# EAGLE design 328_v2 (EAGLE 7.2.0)
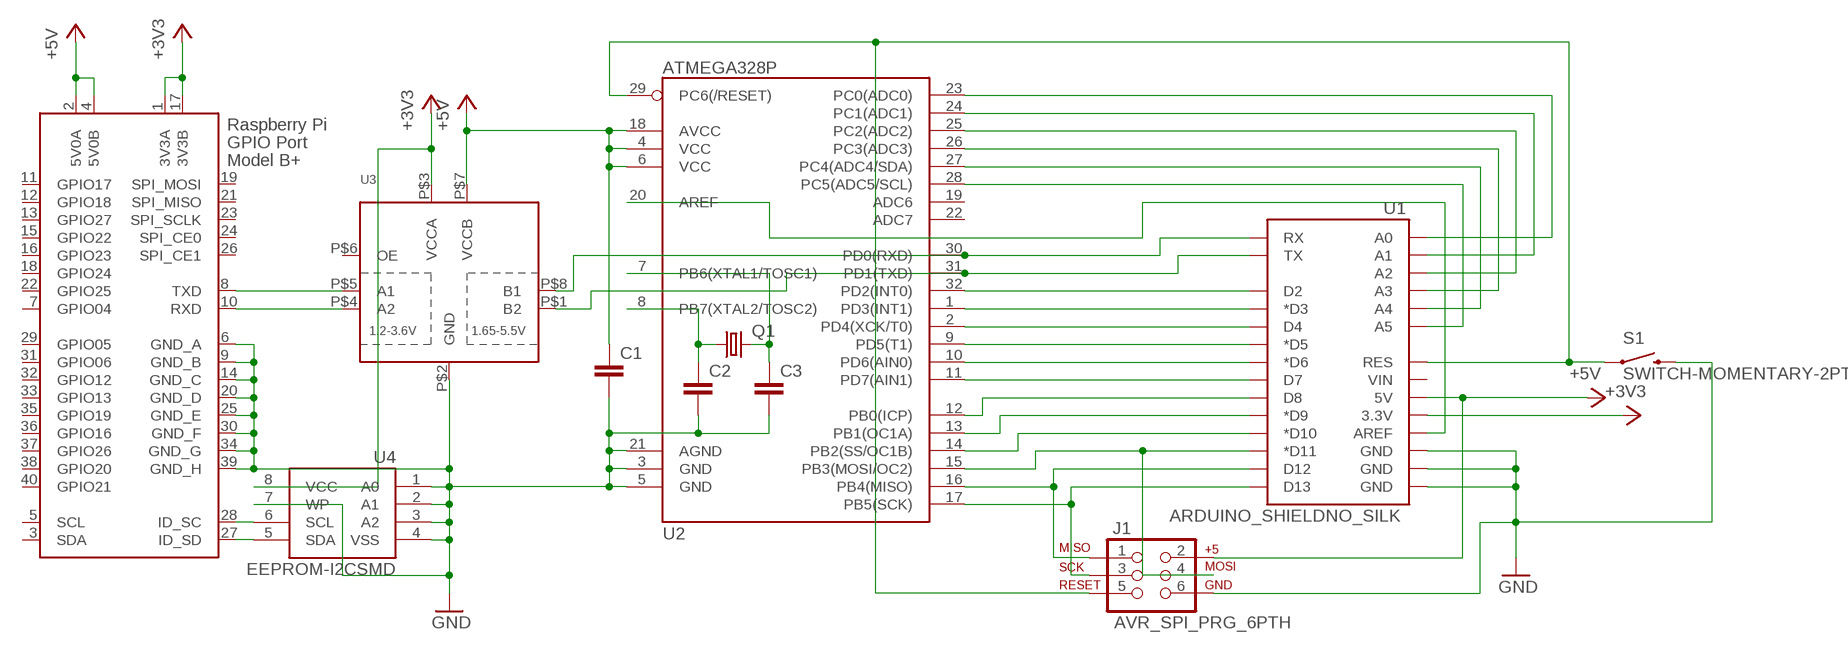
[diagram p0: schematic, sheet 1]

## Parts
C1  C-EUC0805K  [C0805K]
C2  C-EUC0805K  [C0805K]
C3  C-EUC0805K  [C0805K]
J1  AVR_SPI_PRG_6PTH  [2X3]
Q1  CRYSTALCTS406  [CTS406]
S1  SWITCH-MOMENTARY-2PTH  [TACTILE-PTH]
U1  ARDUINO_SHIELDNO_SILK  [DUEMILANOVE_VIAS]
U2  ATMEGA328P  ATMEGA328_SMT  [TQFP32-08]
U3  TXS0102  [VFSOP-8]
U4  EEPROM-I2CSMD  [SO08]
X1  RASPI_BOARD_B+#_H  [RASPI_BOARD_B+HAT]

## Nets
+3V3: U1.3.3V U3.P$3(VCCA) U4.8(VCC) X1.1(3V3A) X1.17(3V3B)
+5V: C1.1 J1.2 U1.5V U2.4(VCC) U2.6(VCC) U2.18(AVCC) U3.P$7(VCCB) X1.2(5V0A) X1.4(5V0B)
GND: C1.2 C2.2 C3.2 J1.6 S1.3 U1.GND@0(GND) U1.GND@1(GND) U1.GND@2(GND) U2.3(GND) U2.5(GND) U2.21(AGND) U3.P$2(GND) U4.1(A0) U4.2(A1) U4.3(A2) U4.4(VSS) U4.7(WP) X1.6(GND_A) X1.9(GND_B) X1.14(GND_C) X1.20(GND_D) X1.25(GND_E) X1.30(GND_F) X1.34(GND_G) X1.39(GND_H)
N$1: U3.P$5(A1) X1.8(TXD)
N$2: U3.P$4(A2) X1.10(RXD)
N$3: U1.RX U2.30(PD0(RXD)) U3.P$8(B1)
N$4: U1.TX U2.31(PD1(TXD)) U3.P$1(B2)
N$5: J1.1 U1.D12 U2.16(PB4(MISO))
N$6: U1.AREF U2.20(AREF)
N$7: U1.D2 U2.32(PD2(INT0))
N$8: U1.D3(*D3) U2.1(PD3(INT1))
N$9: U1.D4 U2.2(PD4(XCK/T0))
N$10: U1.D5(*D5) U2.9(PD5(T1))
N$11: U1.D6(*D6) U2.10(PD6(AIN0))
N$12: U1.D7 U2.11(PD7(AIN1))
N$13: U1.D8 U2.12(PB0(ICP))
N$14: U1.D9(*D9) U2.13(PB1(OC1A))
N$15: U1.D10(*D10) U2.14(PB2(SS/OC1B))
N$16: C3.1 Q1.3 U2.7(PB6(XTAL1/TOSC1))
N$17: J1.4 U1.D11(*D11) U2.15(PB3(MOSI/OC2))
N$18: J1.3 U1.D13 U2.17(PB5(SCK))
N$19: U1.A5 U2.28(PC5(ADC5/SCL))
N$20: U1.A4 U2.27(PC4(ADC4/SDA))
N$21: U1.A3 U2.26(PC3(ADC3))
N$22: U1.A2 U2.25(PC2(ADC2))
N$23: U1.A1 U2.24(PC1(ADC1))
N$24: U1.A0 U2.23(PC0(ADC0))
N$25: J1.5 S1.1 U1.RES U2.29(PC6(/RESET))
N$26: U4.5(SDA) X1.27(ID_SD)
N$27: U4.6(SCL) X1.28(ID_SC)
N$28: C2.1 Q1.1 U2.8(PB7(XTAL2/TOSC2))
Unconnected: U1.VIN U2.19(ADC6) U2.22(ADC7) U3.P$6(OE) X1.3(SDA) X1.5(SCL) X1.7(GPIO04) X1.11(GPIO17) X1.12(GPIO18) X1.13(GPIO27) X1.15(GPIO22) X1.16(GPIO23) X1.18(GPIO24) X1.19(SPI_MOSI) X1.21(SPI_MISO) X1.22(GPIO25) X1.23(SPI_SCLK) X1.24(SPI_CE0) X1.26(SPI_CE1) X1.29(GPIO05) X1.31(GPIO06) X1.32(GPIO12) X1.33(GPIO13) X1.35(GPIO19) X1.36(GPIO16) X1.37(GPIO26) X1.38(GPIO20) X1.40(GPIO21)

## Library data of the parts
C1-C3 = resistor:C-EU: CAPACITOR, European symbol
J1 = SparkFun-Connectors:AVR_SPI_PRG_6: AVR ISP 6 Pin This is the reduced ISP connector for AVR programming. Common on Arduino. This footprint will take up less PCB space and can be used with a 10-pin to 6-pin adapter such as SKU: BOB-08508 **Special note about "TEST_POINT" package. The stop mask is on the top side, so if you want your programming test points to be on the bottom of your board, make sure to place this package on the bottom side of the board. This also ensure that the orientation to program from the bottom side will be correct.
Q1 = crystal:CRYSTAL: CRYSTAL; OC_FARNELL: unknown; OC_NEWARK: unknown
S1 = SparkFun-Electromechanical:SWITCH-MOMENTARY-2: Various NO switches- pushbuttons, reed, etc
U1 = SparkFun-Boards:ARDUINO_SHIELD: Arduino shield footprint
U2 = SparkFun-DigitalIC:ATMEGA328_SMT: 32-Pin Atmega328 part Commonly used on Arduino compatible boards Available in QFP and QFN packages TQFP is IC-09069 QFN is non-stock; PROD_ID: IC-09069
U3 = adafruit:TXS0102: 2-Bit Bi-Directional Level Shifter (I2C, etc.) Designed for I2C devices and has internal pullups. Not to be confused with TXB010x series. 1.2V-3.6V (VCCA) to 1.65V-5.5V (VCCB) bi-directional level shifter with auto direction sensing. Max data rate - 24Mbps (Push Pull), 2Mbps (Open Drain) Digikey: 296-21931-1-ND
U4 = SparkFun-DigitalIC:EEPROM-I2C: I2C EEPROM chips, 24LC256 (and others)
X1 = raspberrypi_bastelstube_v13:RASPI_BOARD_B+#: Raspberry Pi GPIO connector with markings for the outer dimensions of the Raspberry Pi board model B+ with different sets of drill holes or mounting pads All pins connected

## Board
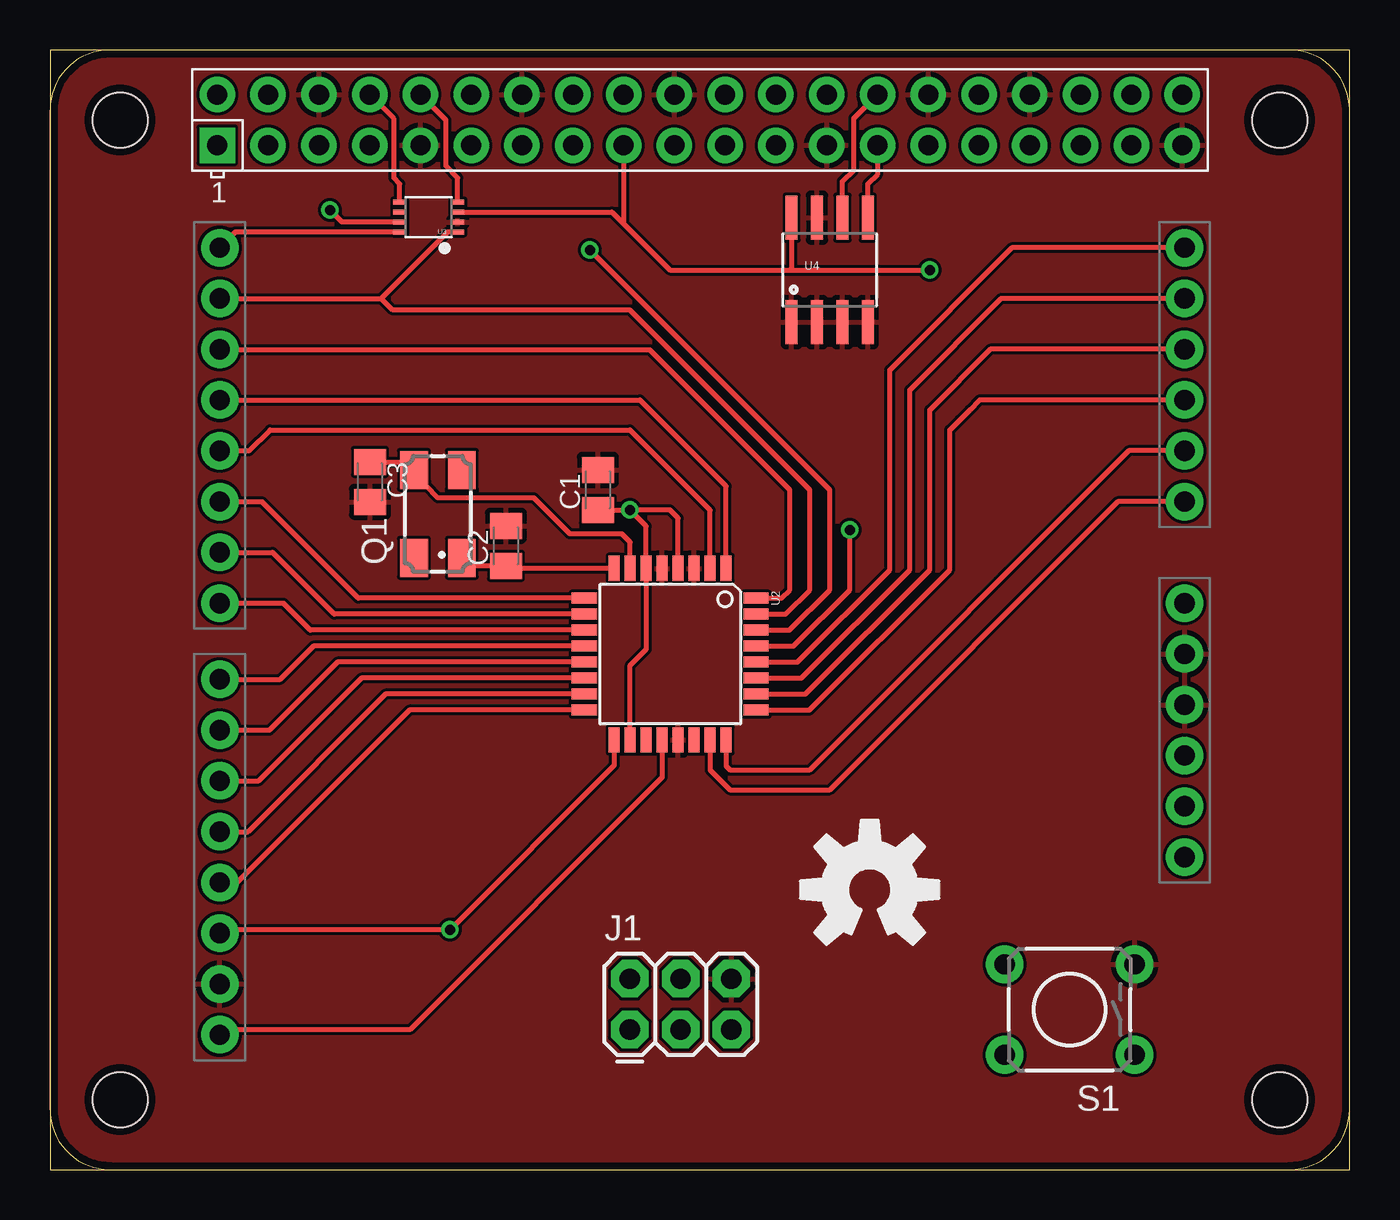
[diagram p1: board, top side]
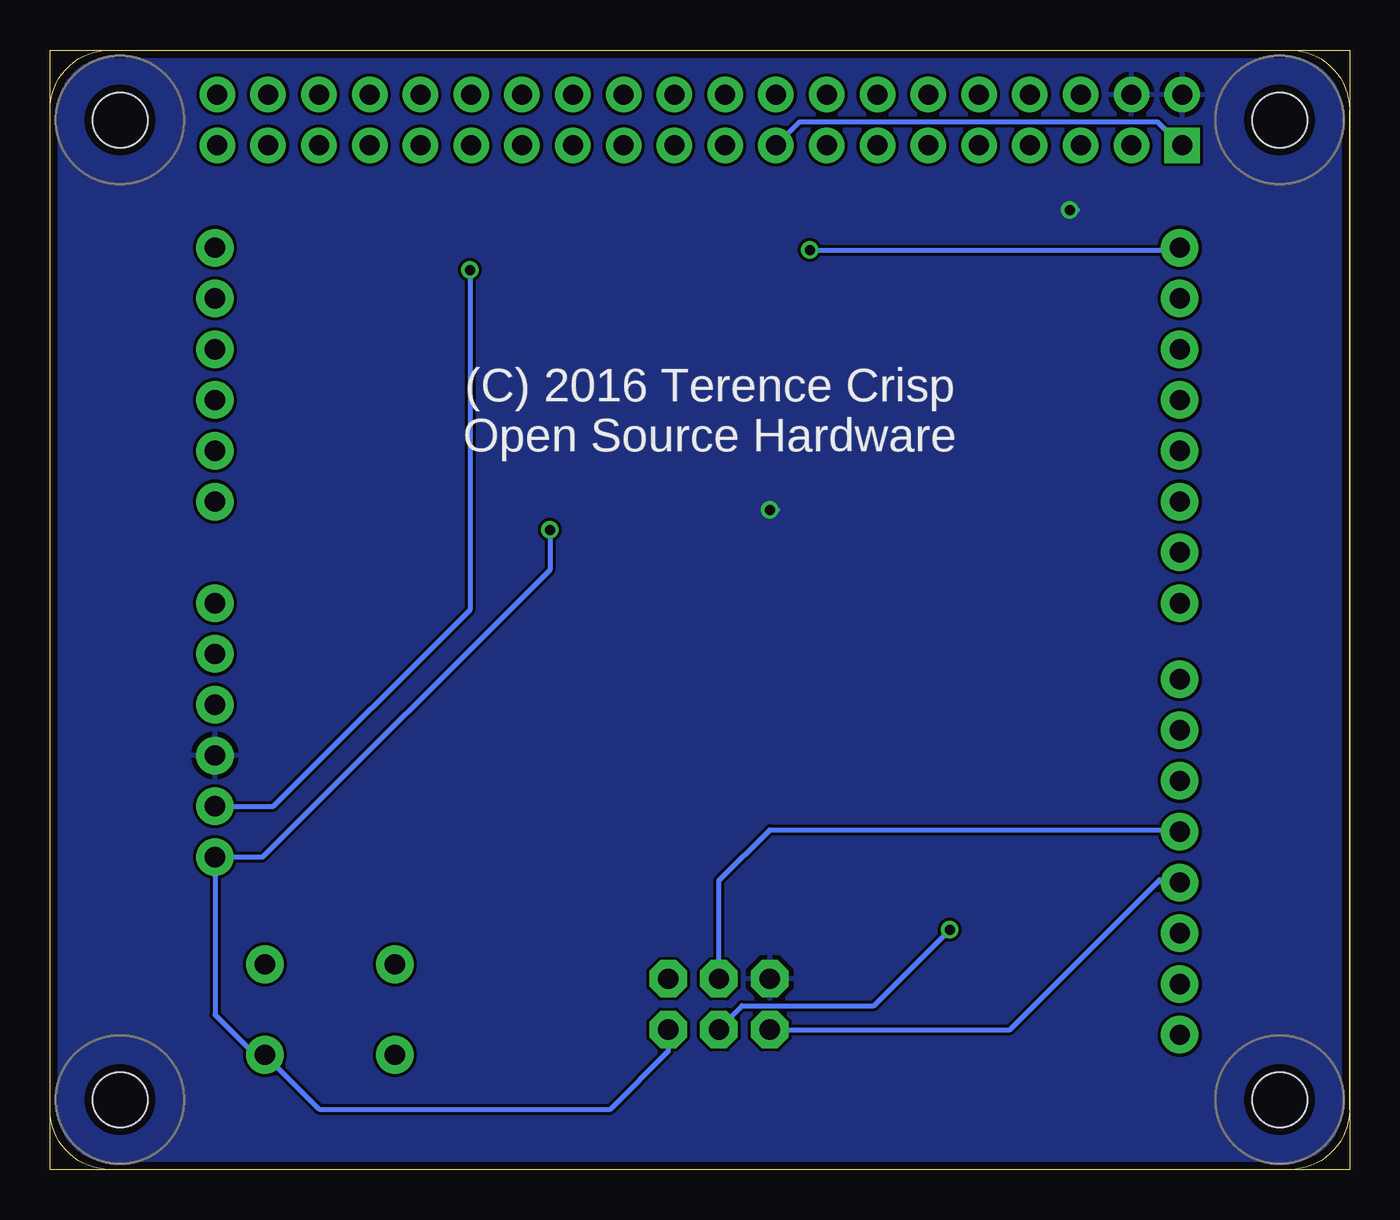
[diagram p2: board, bottom side, seen from below]

Size 65 x 56 mm. Coordinates in mm from the lower left corner, seen from the top.
Outline: 0,0 65,0 65,56 0,56 0,0
Copper layers (1*16): Top 0.0356mm / dielectric 1.5011mm / Bottom 0.0356mm
Design rules "LaenPCBOrder": minimum track width 6mil, minimum drill 13mil, track to track 6mil, track to pad 6mil, pad to pad 6mil, via to via 6mil, smd to smd 6mil, copper to edge 15mil, drill to drill 6mil, minimum pad ring 7mil, minimum via ring 7mil, stop-mask expansion 3mil, vias tented up to drill 0mil, thermal gap 10mil

### Footprints (pad centres in the part's own frame; a part is rotated, then mirrored left to right if it is on the bottom)
C0805K = smd 1.3 x 1.6: 1 -1,0; 2 1,0
2X3 = drill 1.016 pad 1.88 octagon: 1 0,0; 2 0,2.54; 3 2.54,0; 4 2.54,2.54; 5 5.08,0; 6 5.08,2.54
CTS406 = smd 1.9 x 1.4: 1 -2.2,-1.2; 2 2.2,-1.2; 3 2.2,1.2; 4 -2.2,1.2
TACTILE-PTH = drill 1.016 pad 1.88: 1 -3.251,2.261; 2 3.251,2.261; 3 -3.251,-2.261; 4 3.251,-2.261
DUEMILANOVE_VIAS = drill 1.016 pad 1.88: 3.3V 50.8,13.97; 5V 50.8,16.51; A0 50.8,29.21; A1 50.8,31.75; A2 50.8,34.29; A3 50.8,36.83; A4 50.8,39.37; A5 50.8,41.91; AREF 2.54,2.54; D2 2.54,36.83; D3 2.54,34.29; D4 2.54,31.75; D5 2.54,29.21; D6 2.54,26.67; D7 2.54,24.13; D8 2.54,20.32; D9 2.54,17.78; D10 2.54,15.24; D11 2.54,12.7; D12 2.54,10.16; D13 2.54,7.62; GND@0 50.8,19.05; GND@1 50.8,21.59; GND@2 2.54,5.08; RES 50.8,11.43; RX 2.54,41.91; TX 2.54,39.37; VIN 50.8,24.13
TQFP32-08 = smd 1.27 x 0.559: 1 -4.293,2.8; 2 -4.293,2; 3 -4.293,1.2; 4 -4.293,0.4; 5 -4.293,-0.4; 6 -4.293,-1.2; 7 -4.293,-2; 8 -4.293,-2.8; 17 4.293,-2.8; 18 4.293,-2; 19 4.293,-1.2; 20 4.293,-0.4; 21 4.293,0.4; 22 4.293,1.2; 23 4.293,2; 24 4.293,2.8 | smd 0.559 x 1.27: 9 -2.8,-4.293; 10 -2,-4.293; 11 -1.2,-4.293; 12 -0.4,-4.293; 13 0.4,-4.293; 14 1.2,-4.293; 15 2,-4.293; 16 2.8,-4.293; 25 2.8,4.293; 26 2,4.293; 27 1.2,4.293; 28 0.4,4.293; 29 -0.4,4.293; 30 -1.2,4.293; 31 -2,4.293; 32 -2.8,4.293
VFSOP-8 = smd 0.25 x 0.65: P$1 -0.75,-1.45; P$2 -0.25,-1.45; P$3 0.25,-1.45; P$4 0.75,-1.45; P$5 0.75,1.45; P$6 0.25,1.45; P$7 -0.25,1.45; P$8 -0.75,1.45
SO08 = smd 0.61 x 2.21: 1 -1.905,-2.616; 2 -0.635,-2.616; 3 0.635,-2.616; 4 1.905,-2.616; 5 1.905,2.616; 6 0.635,2.616; 7 -0.635,2.616; 8 -1.905,2.616
RASPI_BOARD_B+HAT = drill 1 pad 1.778 square: 1 8.37,51.23 | drill 1 pad 1.778: 2 8.37,53.77; 3 10.91,51.23; 4 10.91,53.77; 5 13.45,51.23; 6 13.45,53.77; 7 15.99,51.23; 8 15.99,53.77; 9 18.53,51.23; 10 18.53,53.77; 11 21.07,51.23; 12 21.07,53.77; 13 23.61,51.23; 14 23.61,53.77; 15 26.15,51.23; 16 26.15,53.77; 17 28.69,51.23; 18 28.69,53.77; 19 31.23,51.23; 20 31.23,53.77; 21 33.77,51.23; 22 33.77,53.77; 23 36.31,51.23; 24 36.31,53.77; 25 38.85,51.23; 26 38.85,53.77; 27 41.39,51.23; 28 41.39,53.77; 29 43.93,51.23; 30 43.93,53.77; 31 46.47,51.23; 32 46.47,53.77; 33 49.01,51.23; 34 49.01,53.77; 35 51.55,51.23; 36 51.55,53.77; 37 54.09,51.23; 38 54.09,53.77; 39 56.63,51.23; 40 56.63,53.77 | hole 2.75: 3.5,3.5; 3.5,52.5; 61.5,3.5; 61.5,52.5

### Placement (x,y rotation side)
C1  27.4,34 90 top
C2  22.8,31.2 90 top
C3  16,34.4 270 top
J1  29,7 0 top
Q1  19.4,32.8 90 top
S1  51,8 180 top
U1  5.95,4.2 0 top
U2  31.02,25.78 270 top
U3  18.94,47.64 90 top
U4  39,45 0 top
U$1  [OSHW-LOGO-L]  41,14 0 top
X1  0,0 0 top

### Tracks (layer width: path | path; a pad name or v marks a point on that pad's centre or on a via)
+3V3  (via drill 0.5)
  Top 0.254: X1.17 28.69,47.31 | 28.69,47.31 31,45 37,45 | 37,45 v44,45 | U4.8 37.09,45.09 37,45 | U3.P$3 28.11,47.89 28.69,47.31
  Bottom 0.254: v44,45 44,28 53.83,18.17 U1.3.3V | X1.1 8.43,51.23 9.6,52.4 27.52,52.4 X1.17
+5V  (via drill 0.5)
  Top 0.254: U3.P$7 14.61,47.39 v14,48 | U2.18 29.02,25.22 29.82,26.02 U2.6 29.82,32.18 v29,33 | U2.4 31.42,32.58 31,33 v29,33 | C1.1 v29,33
  Bottom 0.254: v14,48 13.6,48 | v29,33 28.6,33
  pour Bottom: 0,0 65,0 65,56 0,56
GND
  pour Top: 0,0 65,0 65,56 0,56
N$1
  Top 0.254: U3.P$5 17.49,49.31 17.2,49.6 17.2,52.56 X1.8
N$2
  Top 0.254: U3.P$4 20.39,49.61 19.8,50.2 19.8,52.5 X1.10
N$3  (via drill 0.5)
  Top 0.254: U2.30 36.98,26.98 39,29 39,34 v27,46 | U3.P$8 9.27,46.89 U1.RX
  Bottom 0.254: v27,46 8.6,46 U1.RX
N$4
  Top 0.254: U2.31 36.78,27.78 38,29 38,34 29,43 17.14,43 16.57,43.57 | U3.P$1 19.89,46.89 16.57,43.57 | U1.TX 16.57,43.57
N$5
  Top 0.254: U2.16 17.98,22.98 9.36,14.36 U1.D12
  Bottom 0.254: J1.1 17,7 9.5,14.5 9.14,14.5 9,14.36 U1.D12
N$6
  Top 0.254: U2.20 30.62,19.62 18,7 8.75,7 U1.AREF
N$7
  Top 0.254: U2.32 36.58,28.58 37,29 37,34 30,41 8.52,41 U1.D2
N$8
  Top 0.254: U2.1 33.82,34.18 29.51,38.49 U1.D3
N$9
  Top 0.254: U2.2 33.02,32.98 29,37 11,37 9.95,35.95 U1.D4
N$10
  Top 0.254: U2.9 15.42,28.58 10.59,33.41 U1.D5
N$11
  Top 0.254: U2.10 14.22,27.78 11.13,30.87 U1.D6
N$12
  Top 0.254: U2.11 13.02,26.98 11.67,28.33 U1.D7
N$13
  Top 0.254: U2.12 13.18,26.18 11.52,24.52 U1.D8
N$14
  Top 0.254: U2.13 14.38,25.38 10.98,21.98 U1.D9
N$15
  Top 0.254: U2.14 15.58,24.58 10.44,19.44 U1.D10
N$16
  Top 0.254: U2.7 29.02,31.38 28.6,31.8 26,31.8 24.2,33.6 19.4,33.6 18.8,34.2 18.8,34.4 Q1.3 17.8,35.4 C3.1
N$17
  Top 0.254: U2.15 16.78,23.78 9.9,16.9 U1.D11
  Bottom 0.254: J1.4 31.54,14.46 29,17 8.59,17 U1.D11
N$18  (via drill 0.5)
  Top 0.254: U2.17 28.22,20.22 v20,12 18,12 8.67,12 U1.D13
  Bottom 0.254: J1.3 31.54,7.06 30.4,8.2 23.8,8.2 v20,12
N$19
  Top 0.254: U2.28 37.38,25.38 42,30 42,40 48.11,46.11 U1.A5
N$20
  Top 0.254: U2.27 37.58,24.58 43,30 43,39 47.57,43.57 U1.A4
N$21
  Top 0.254: U2.26 37.78,23.78 44,30 44,38 47.03,41.03 U1.A3
N$22
  Top 0.254: U2.25 37.98,22.98 45,30 45,37 45.5,37.5 46,38 46.49,38.49 U1.A2
N$23
  Top 0.254: U2.24 33.82,20.18 34,20 38,20 53.95,35.95 U1.A1
N$24
  Top 0.254: U2.23 33.02,19.98 34,19 39,19 53.41,33.41 U1.A0
N$25  (via drill 0.5)
  Top 0.254: U2.29 37.18,26.18 40,29 v40,32
  Bottom 0.254: J1.5 34.08,5.92 37,3 51.51,3 S1.1 54.74,5.74 56.75,7.75 U1.RES 54.37,15.63 40,30 v40,32
N$26
  Top 0.254: U4.5 40.91,49.3 41.4,49.8 X1.27
N$27
  Top 0.254: U4.6 39.63,49.44 40.2,50 40.2,52.58 X1.28
N$28
  Top 0.254: U2.8 22.93,30.07 C2.1 21,30.2 Q1.1

### Text on the board
_bsilk: (C) 2016 Terence Crisp / Open Source Hardware